# EAGLE schematic esquematico-educaino-V2 (EAGLE 7.6.0)
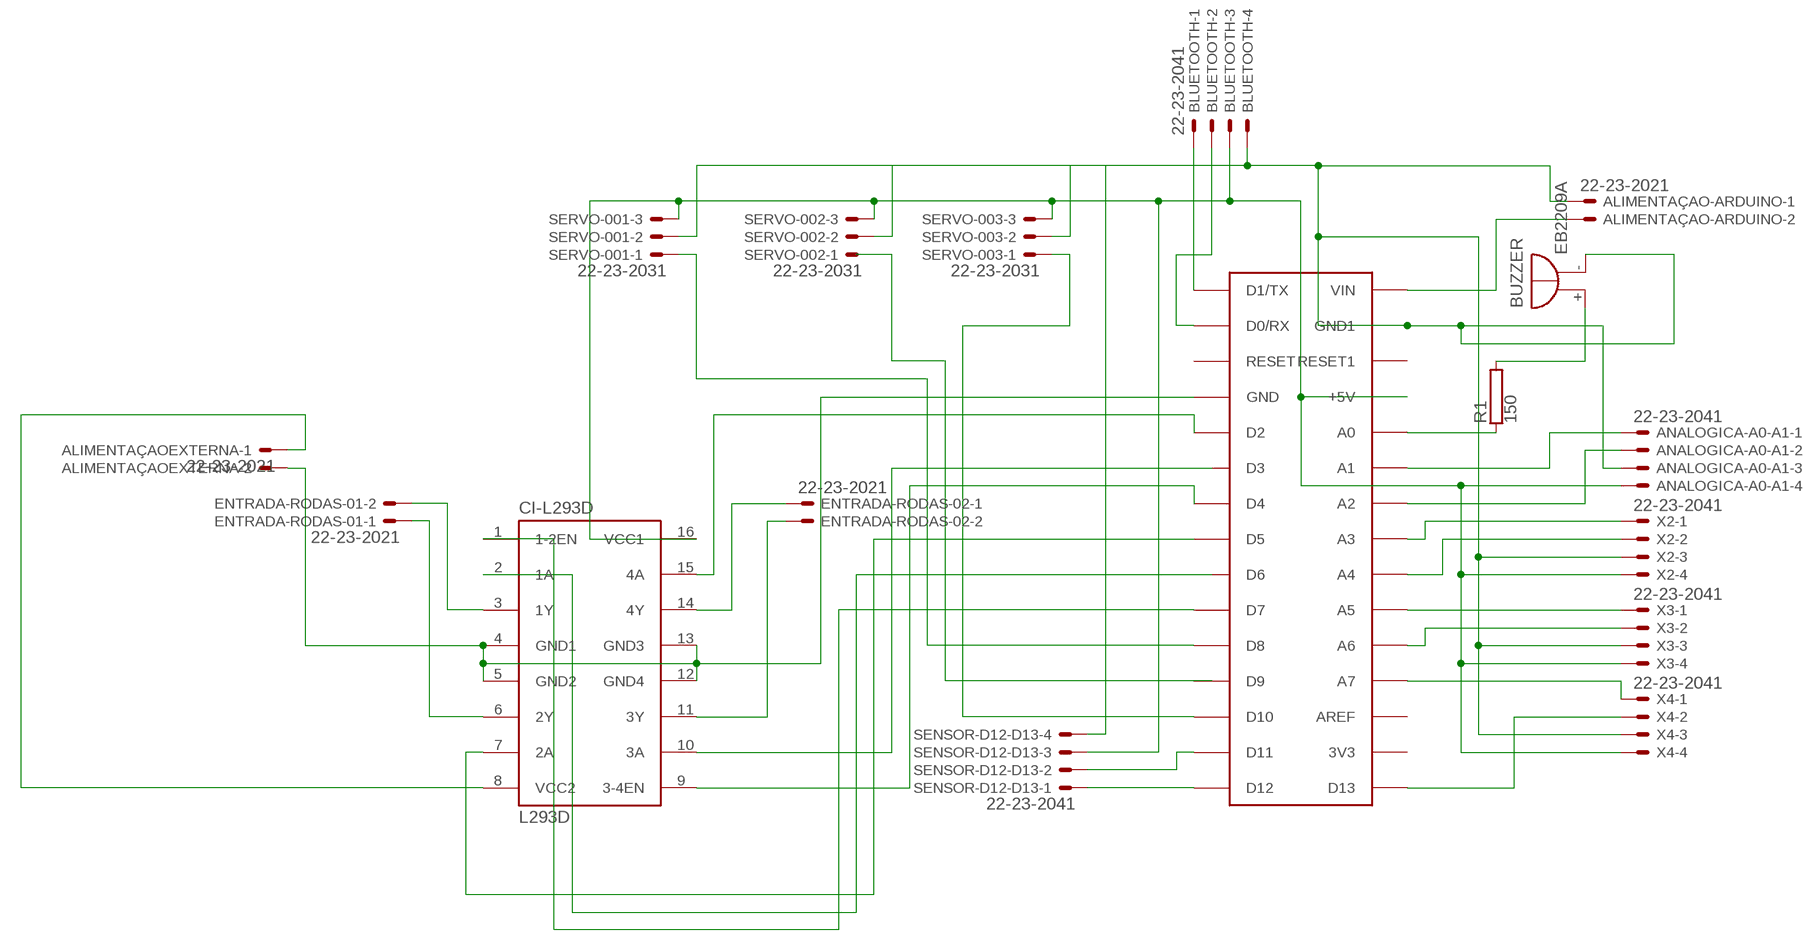
[diagram p0: schematic, sheet 1]

## Parts
ALIMENTAÇAO-ARDUINO  22-23-2021  [22-23-2021]
ALIMENTAÇAOEXTERNA  22-23-2021  [22-23-2021]
ANALOGICA-A0-A1  22-23-2041  [22-23-2041]
BLUETOOTH  22-23-2041  [22-23-2041]
BUZZER  EB2209A  [EB2209A]
CI-L293D  L293D  [DIL16]
ENTRADA-RODAS-01  22-23-2021  [22-23-2021]
ENTRADA-RODAS-02  22-23-2021  [22-23-2021]
R1  150  RMG100-V  [TO-247-2V]
SENSOR-D12-D13  22-23-2041  [22-23-2041]
SERVO-001  22-23-2031  [22-23-2031]
SERVO-002  22-23-2031  [22-23-2031]
SERVO-003  22-23-2031  [22-23-2031]
U$1  ARDUINONANO  [PDIP-32]
X2  22-23-2041  [22-23-2041]
X3  22-23-2041  [22-23-2041]
X4  22-23-2041  [22-23-2041]

## Nets
N$1: ALIMENTAÇAOEXTERNA.2 CI-L293D.4(GND1) CI-L293D.5(GND2) CI-L293D.12(GND4) CI-L293D.13(GND3) U$1.GND
N$2: CI-L293D.1(1-2EN) U$1.D7
N$3: CI-L293D.3(1Y) ENTRADA-RODAS-01.2
N$4: ALIMENTAÇAO-ARDUINO.1 ANALOGICA-A0-A1.3 BLUETOOTH.4 BUZZER.- SENSOR-D12-D13.4 SERVO-001.2 SERVO-002.2 SERVO-003.2 U$1.GND1 X2.3 X3.3 X4.3
N$5: ALIMENTAÇAOEXTERNA.1 CI-L293D.8(VCC2)
N$6: CI-L293D.6(2Y) ENTRADA-RODAS-01.1
N$7: CI-L293D.14(4Y) ENTRADA-RODAS-02.1
N$8: CI-L293D.11(3Y) ENTRADA-RODAS-02.2
N$9: CI-L293D.2(1A)
N$10: CI-L293D.7(2A) U$1.D5
N$11: CI-L293D.15(4A) U$1.D2
N$12: CI-L293D.10(3A)
N$13: CI-L293D.9(3-4EN) U$1.D4
N$14: SERVO-001.1 U$1.D8
N$16: SERVO-003.1 U$1.D10
N$17: SENSOR-D12-D13.1 U$1.D12
N$18: SENSOR-D12-D13.2 U$1.D11
N$19: ALIMENTAÇAO-ARDUINO.2 U$1.VIN
N$20: BUZZER.+ R1.2
N$21: R1.1 U$1.A0
N$22: ANALOGICA-A0-A1.1 U$1.A1
N$23: ANALOGICA-A0-A1.2 U$1.A2
N$24: U$1.A3 X2.1
N$25: U$1.A4 X2.2
N$26: U$1.A5 X3.1
N$27: U$1.A6 X3.2
N$28: U$1.A7 X4.1
N$29: U$1.D13 X4.2
N$30: BLUETOOTH.1 U$1.D1/TX
N$31: BLUETOOTH.2 U$1.D0/RX
SERVO-001: ANALOGICA-A0-A1.4 BLUETOOTH.3 CI-L293D.16(VCC1) SENSOR-D12-D13.3 SERVO-001.3 SERVO-002.3 SERVO-003.3 U$1.+5V X2.4 X3.4 X4.4
Unconnected: SERVO-002.1 U$1.3V3 U$1.AREF U$1.D3 U$1.D6 U$1.D9 U$1.RESET U$1.RESET1

## Library data of the parts
ALIMENTAÇAO-ARDUINO ALIMENTAÇAOEXTERNA ENTRADA-RODAS-01 ENTRADA-RODAS-02 = con-molex:22-23-2021: .100" (2.54mm) Center Header - 2 Pin; MF: MOLEX; MPN: 22-23-2021; OC_FARNELL: 1462926; OC_NEWARK: 25C3832
ANALOGICA-A0-A1 BLUETOOTH SENSOR-D12-D13 X2-X4 = con-molex:22-23-2041: .100" (2.54mm) Center Header - 4 Pin; MF: MOLEX; MPN: 22-23-2041; OC_FARNELL: 1462920; OC_NEWARK: 38C0355
BUZZER = buzzer:EB2209A: BUZZER Source: Buerklin; OC_FARNELL: unknown; OC_NEWARK: unknown
CI-L293D = st-microelectronics:L293D: PUSH-PULL 4 CHANNEL DRIVER; MPN: L293D; OC_FARNELL: 9589619; OC_NEWARK: 56P8249
R1 = resistor-power:RMG100: TO-247 Power Resistor - RMG 100 Series Source: www.token.com.tw .. power-resistor-rmg100pdf; OC_FARNELL: unknown; OC_NEWARK: unknown
SERVO-001-SERVO-003 = con-molex:22-23-2031: .100" (2.54mm) Center Header - 3 Pin; MF: MOLEX; MPN: 22-23-2031; OC_FARNELL: 1462950; OC_NEWARK: 30C0862
U$1 = jet-lib:ARDUINONANO